# Altium schematic sheet LSM6DS3_Breakout.SchDoc: LSM6DS3_Breakout
size 283 x 204 mm; Origin: Eagle; OriginPath: D:\_Studies\2025\Skripsie\Altium\Imports\LSM6DS3_Breakout.sch; OriginSheet: 1; DESIGNER: DESIGNER; VERSION: VERSION; Date: 2025/02/08 17:41:50; SheetNumber: 1; GateName_1: G$1; SymbolName_1: LETTER_L; LibraryName: SparkFun-Aesthetics; DeviceSetName: FRAME-LETTER; GateName_2: V; SymbolName_2: DOCFIELD; Sheet: Sheet:; REV: REV:; ReleasedundertheCreativeCommons: Released under the Creative Commons; AttributionShare-Alike4.0License: Attribution Share-Alike 4.0 License; https://creativecommons.org/licenses/by-sa/4.0/: https://creativecommons.org/licenses/by-sa/4.0/; Designby: Design by:
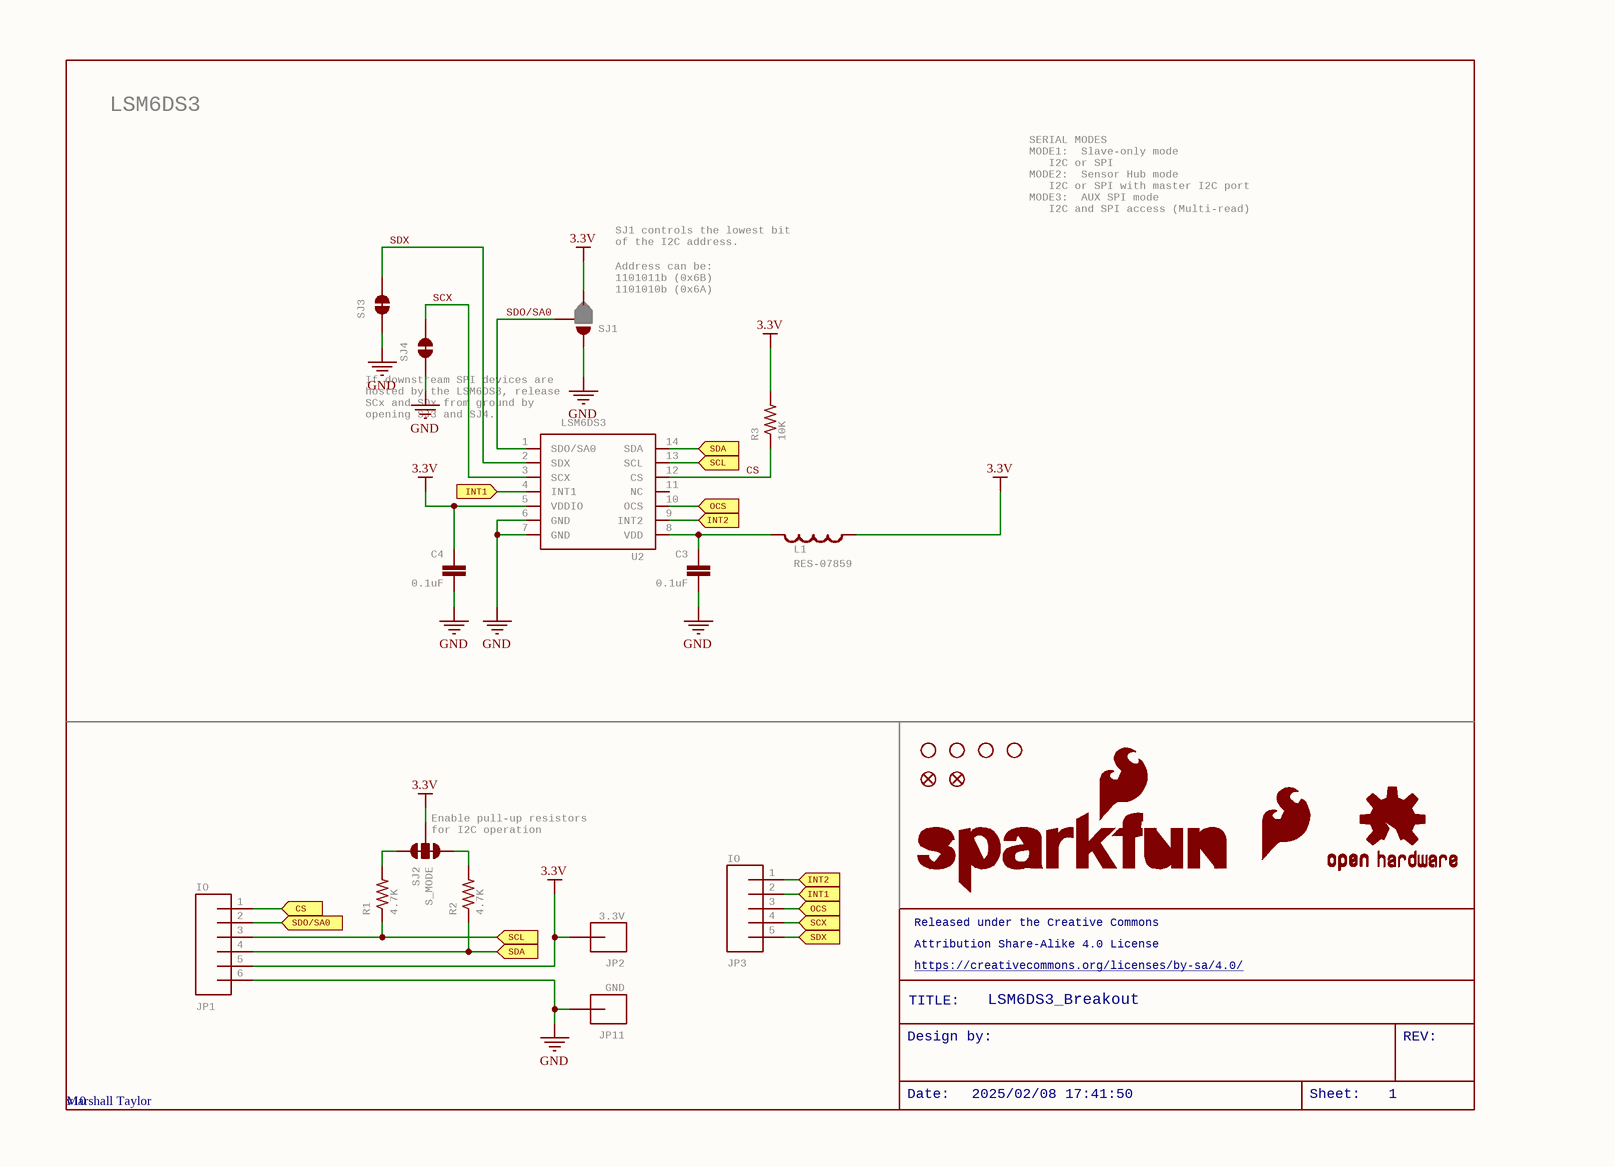
[diagram p0: LSM6DS3_Breakout.SchDoc]

## Parts
C3  0.1uF  [0603-CAP]
C4  0.1uF  [0603-CAP]
FID1  FIDUCIAL1X2  [FIDUCIAL-1X2]  (value not drawn)
FID2  FIDUCIAL1X2  [FIDUCIAL-1X2]  (value not drawn)
JP1  IO  [1X06_NO_SILK_YES_STOP]
JP2  3.3V  [1X01_NO_SILK]
JP3  IO  [1X05]
JP11  GND  [1X01_NO_SILK]
L1  RES-07859  [0603]
LOGO1  SFE_LOGO_FLAME.2_INCH  [SFE_LOGO_FLAME_.2]  (value not drawn)
LOGO2  OSHW-LOGOS  [OSHW-LOGO-S]  (value not drawn)
LOGO3  SFE_LOGO_NAME_FLAME.1_INCH  [SFE_LOGO_NAME_FLAME_.1]  (value not drawn)
R1  4.7K  [0603-RES]
R2  4.7K  [0603-RES]
R3  10K  [0603-RES]
SJ1  JUMPER-PAD-3-2OF3_NC_BY_PASTE  [PAD-JUMPER-3-2OF3_NC_BY_PASTE_YES_SILK_FULL_BOX]  (value not drawn)
SJ2  S_MODE  [PAD-JUMPER-3-3OF3_NC_BY_TRACE_YES_SILK_FULL_BOX]
SJ3  JUMPER-PAD-2-NC_BY_TRACE  [PAD-JUMPER-2-NC_BY_TRACE_YES_SILK]  (value not drawn)
SJ4  JUMPER-PAD-2-NC_BY_TRACE  [PAD-JUMPER-2-NC_BY_TRACE_YES_SILK]  (value not drawn)
STANDOFF1  STAND-OFF  [STAND-OFF]  (value not drawn)
STANDOFF2  STAND-OFF  [STAND-OFF]  (value not drawn)
STANDOFF3  STAND-OFF  [STAND-OFF]  (value not drawn)
STANDOFF4  STAND-OFF  [STAND-OFF]  (value not drawn)
U2  LSM6DS3  [LGA14L_DOT_INDICATOR]

## Ports
CS (in), INT1 (in), INT2 (in), OCS (in), SCL (in), SCX (in), SDA (in), SDO/SA0 (in), SDX (in)

## Nets
3.3V: C4.1 JP1.5 JP2.1 L1.1 R3.2 SJ1.3 SJ2.2 U2.5(VDDIO)
GND: C3.2 C4.2 JP1.6 JP11.1 SJ1.1 SJ3.1 SJ4.1 U2.6(GND) U2.7(GND)
CS: R3.1 U2.12(CS)
CS: JP1.1 ; port CS  [a separate net that carries the same name]
INT1: JP3.2 U2.4(INT1) ; port INT1
INT2: JP3.1 U2.9(INT2) ; port INT2
OCS: JP3.3 U2.10(OCS) ; port OCS
SCL: JP1.3 R1.1 U2.13(SCL) ; port SCL
SCX: SJ4.2 U2.3(SCX)
SCX: JP3.4 ; port SCX  [a separate net that carries the same name]
SDA: JP1.4 R2.1 U2.14(SDA) ; port SDA
SDO/SA0: SJ1.2 U2.1(SDO/SA0)
SDO/SA0: JP1.2 ; port SDO/SA0  [a separate net that carries the same name]
SDX: SJ3.2 U2.2(SDX)
SDX: JP3.5 ; port SDX  [a separate net that carries the same name]
NetC3_1: C3.1 L1.2 U2.8(VDD)
NetR1_2: R1.2 SJ2.1
NetR2_2: R2.2 SJ2.3

Not connected (* = marked no-connect by the designer): U2 11(NC)

## Notes on the sheet
- LSM6DS3
- SJ1 controls the lowest bit
  of the I2C address.
- SERIAL MODES
  MODE1:  Slave-only mode
  I2C or SPI
  MODE2:  Sensor Hub mode
  I2C or SPI with master I2C port
  MODE3:  AUX SPI mode
  I2C and SPI access (Multi-read)
- (near SJ1) Address can be:
  1101011b (0x6B)
  1101010b (0x6A)
- (near SJ4) If downstream SPI devices are
  hosted by the LSM6DS3, release
  SCx and SDx from ground by
  opening SJ3 and SJ4.
- (near SJ2) Enable pull-up resistors
  for I2C operation
- (near LOGO3) Released under the Creative Commons
- (near LOGO3) Attribution Share-Alike 4.0 License
- https://creativecommons.org/licenses/by-sa/4.0/
- Design by:
- TITLE:
- LSM6DS3_Breakout
- REV:
- Marshall Taylor
- v10
- Date:
- 2025/02/08 17:41:50
- Sheet:
- 1

## Library data of the parts
C3 C4 = 0.1UF-100V-10%(0603): CAP-08390; GateName_1: G$1; SymbolName_1: CAP; LibraryName: SparkFun-Capacitors; DeviceSetName: 0.1UF-100V-10%(0603); PROD_ID: CAP-08390
FID1 FID2 = FIDUCIAL1X2: Fiducial Alignment PointsVarious fiducial points for machine vision alignment.; GateName_1: G$1; DeviceName: 1X2; SymbolName_1: FIDUCIAL; LibraryName: SparkFun-Aesthetics; DeviceSetName: FIDUCIAL
JP1 = M06NO_SILK_YES_STOP: Header 6 Standard 6-pin 0.1" header. Use with straight break away headers (SKU : PRT-00116), right angle break away headers (PRT-00553), swiss pins (PRT-00743), machine pins (PRT-00117), and female headers (PRT-00115). Molex polarized connector foot print use with SKU : PRT-08094 with associated crimp pins and housings.   NOTES ON THE VARIANTS LOCK and LOCK_LONGPADS... This footprint was designed to help hold the alignment of a through-hole component (i.e.  6-pin header) while soldering it into place. You may notice that each hole has been shifted either up or down by 0.005 of an inch from it's more standard position (which is a perfectly straight line).  This slight alteration caused the pins (the squares in the middle) to touch the edges of the holes.  Because they are alternating, it causes a "brace" to hold the component in place.  0.005 has proven to be the perfect amount of "off-center" position when using our standard breakaway headers. Although looks a little odd when you look at the bare footprint, once you have a header in there, the alteration is very hard to notice.  Also,if you push a header all the way into place, it is covered up entirely on the bottom side.  This idea of altering the position of holes to aid alignment will be further integrated into the Sparkfun Library for other footprints.  It can help hold any component with 3 or more connection pins.; GateName_1: G$1; SymbolName_1: M06; DeviceName: NO_SILK_YES_STOP; LibraryName: SparkFun-Connectors; DeviceSetName: M06
JP2 JP11 = M01PTH_NO_SILK_YES_STOP: Header 1Standard 1-pin 0.1" header. Use with straight break away headers (SKU : PRT-00116), right angle break away headers (PRT-00553), swiss pins (PRT-00743), machine pins (PRT-00117), and female headers (PRT-00115).; GateName_1: G$1; SymbolName_1: M01; DeviceName: PTH_NO_SILK_YES_STOP; LibraryName: SparkFun-Connectors; DeviceSetName: M01
JP3 = M05PTH: Header 5Standard 5-pin 0.1" header. Use with straight break away headers (SKU : PRT-00116), right angle break away headers (PRT-00553), swiss pins (PRT-00743), machine pins (PRT-00117), and female headers (PRT-00115). Molex polarized connector foot print use with SKU : PRT-08230 with associated crimp pins and housings.; GateName_1: G$1; SymbolName_1: M05; DeviceName: PTH; LibraryName: SparkFun-Connectors; DeviceSetName: M05
L1 = INDUCTOR30OHM,1.8A: Inductors   Basic Inductor/Choke - 0603 and 1206. Footprints are not proven and vary greatly between part numbers. SRN6045- 33uH, 20% 1.4A SDR0403-560KL - 56uH, 10%, 500mA RMS/740mA peak; GateName_1: G$1; SymbolName_1: INDUCTOR; DeviceName: 30OHM,1.8A; LibraryName: SparkFun-Passives; DeviceSetName: INDUCTOR; PROD_ID: RES-07859
LOGO1 = SFE_LOGO_FLAME.2_INCH: SFE Logo, flame only    This is the SparkFun flame logo. The logo on the schematic will always be the same size; the package variant is the height of the flame. Default layer for the logo on the board is tSilk.; GateName_1: G$1; SymbolName_1: SFE_LOGO_FLAME; DeviceName: .2_INCH; LibraryName: SparkFun-Aesthetics; DeviceSetName: SFE_LOGO_FLAME
LOGO2 = OSHW-LOGOS: Open Source Hardware Logo This logo indicates the piece of hardware it is found on incorporates a OSHW license and/or adheres to the definition of open source hardware found here: http://freedomdefined.org/OSHW; GateName_1: G$1; DeviceName: S; SymbolName_1: OSHW-LOGO; LibraryName: SparkFun-Aesthetics; DeviceSetName: OSHW-LOGO
LOGO3 = SFE_LOGO_NAME_FLAME.1_INCH: SFE Logo, name and flame    This is the SparkFun full logo. The logo on the schematic will always be the same size; the package variant is the height of the flame part of the logo. Default layer for the logo on the board is tSilk.; GateName_1: G$1; SymbolName_1: SFE_LOGO_NAME_FLAME; DeviceName: .1_INCH; LibraryName: SparkFun-Aesthetics; DeviceSetName: SFE_LOGO_NAME_FLAME
R1 R2 = 4.7KOHM-1/10W-1%(0603): RES-07857; GateName_1: G$1; SymbolName_1: RESISTOR; LibraryName: SparkFun-Resistors; DeviceSetName: 4.7KOHM-1/10W-1%(0603); PROD_ID: RES-07857
R3 = 10KOHM-1/10W-1%(0603)0603: RES-00824; GateName_1: G$1; SymbolName_1: RESISTOR; DeviceName: 0603; LibraryName: SparkFun-Resistors; DeviceSetName: 10KOHM-1/10W-1%(0603); PROD_ID: RES-00824
SJ1 = JUMPER-PAD-3-2OF3_NC_BY_PASTE: GateName_1: G$1; SymbolName_1: PAD-JUMPER-3-2OF3-NC_BY_PASTE; LibraryName: SparkFun-Passives; DeviceSetName: JUMPER-PAD-3-2OF3_NC_BY_PASTE
SJ2 = JUMPER-PAD-3-NC_BY_TRACE: GateName_1: G$1; SymbolName_1: PAD-JUMPER-3-NC_BY_TRACE; LibraryName: SparkFun-Passives; DeviceSetName: JUMPER-PAD-3-NC_BY_TRACE
SJ3 SJ4 = JUMPER-PAD-2-NC_BY_TRACE: GateName_1: G$1; SymbolName_1: PAD-JUMPER-2-NC_BY_TRACE; LibraryName: SparkFun-Passives; DeviceSetName: JUMPER-PAD-2-NC_BY_TRACE
STANDOFF1-STANDOFF4 = STAND-OFF: #4 Stand Off   This is the mechanical footprint for a #4 phillips button head screw. Use the keepout ring to avoid running the screw head into surrounding components. SKU : PRT-00447; GateName_1: G$1; SymbolName_1: STAND-OFF; LibraryName: SparkFun-Electromechanical; DeviceSetName: STAND-OFF
U2 = LSM6DS3DOT_INDICATION: GateName_1: G$1; PROD_ID: IC-12969; SymbolName_1: LSM6DS3; DeviceName: DOT_INDICATION; LibraryName: LSM6DS3; DeviceSetName: LSM6DS3